# Altium schematic sheet IRSensor.SchDoc
size A4; SheetNumber: 8; SheetTotal: 11
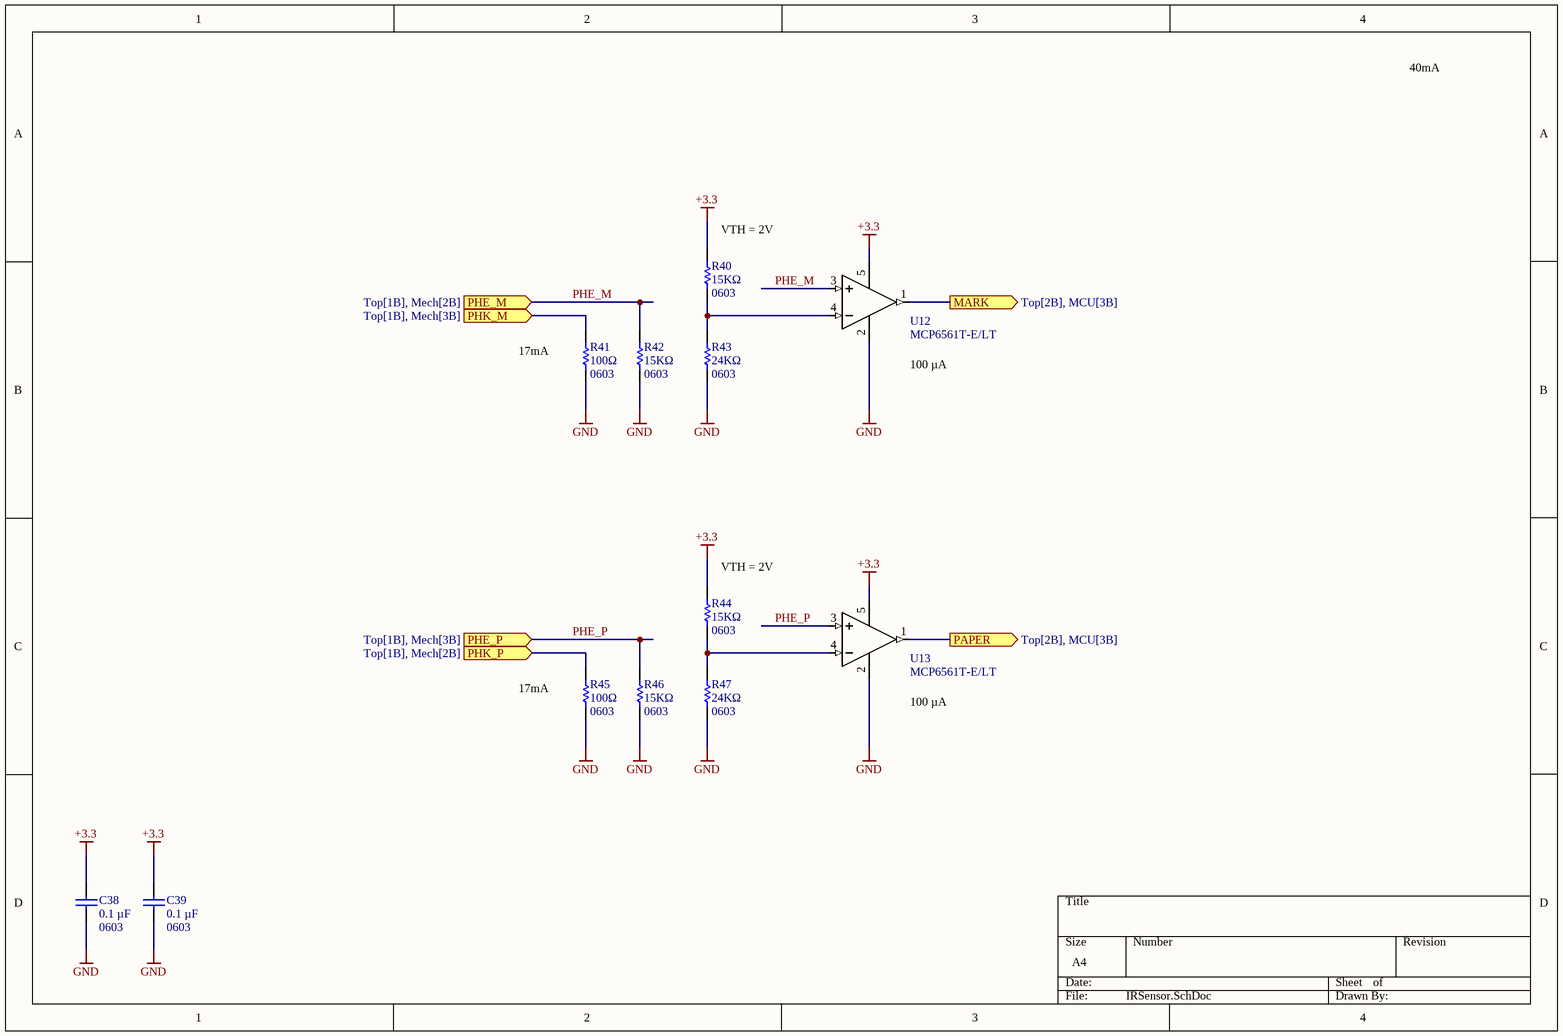
[diagram p0: IRSensor.SchDoc]

## Parts
C38  value 0.1 µF  [0603]  (hidden comment: GRM188R72A104MA35J)
C39  value 0.1 µF  [0603]  (hidden comment: GRM188R72A104MA35J)
R40  value 15KΩ  [0603]  (hidden comment: RMCF0603FG15K0)
R41  value 100Ω  [0603]  (hidden comment: RMCF0603FG100R)
R42  value 15KΩ  [0603]  (hidden comment: RMCF0603FG15K0)
R43  value 24KΩ  [0603]  (hidden comment: RMCF0603FG24K0)
R44  value 15KΩ  [0603]  (hidden comment: RMCF0603FG15K0)
R45  value 100Ω  [0603]  (hidden comment: RMCF0603FG100R)
R46  value 15KΩ  [0603]  (hidden comment: RMCF0603FG15K0)
R47  value 24KΩ  [0603]  (hidden comment: RMCF0603FG24K0)
U12  MCP6561T-E/LT  [SC-70-5]
U13  MCP6561T-E/LT  [SC-70-5]

## Ports
MARK (out, see Top[2B], MCU[3B]), PAPER (out, see Top[2B], MCU[3B]), PHE_M (in, see Top[1B], Mech[2B]), PHE_P (in, see Top[1B], Mech[3B]), PHK_M (in, see Top[1B], Mech[3B]), PHK_P (in, see Top[1B], Mech[2B])

## Nets
+3.3: C38.1 C39.1 R40.2 R44.2 U12.5(V+) U13.5(V+)
GND: C38.2 C39.2 R41.1 R42.1 R43.1 R45.1 R46.1 R47.1 U12.2(V-) U13.2(V-)
MARK: U12.1(OUT) ; port MARK
PAPER: U13.1(OUT) ; port PAPER
PHE_M: R42.2 U12.3(+IN) ; port PHE_M
PHE_P: R46.2 U13.3(+IN) ; port PHE_P
PHK_M: R41.2 ; port PHK_M
PHK_P: R45.2 ; port PHK_P
NetR40_1: R40.1 R43.2 U12.4(-IN)
NetR44_1: R44.1 R47.2 U13.4(-IN)

## Notes on the sheet
- 40mA
- (near R40) VTH = 2V
- (near R41) 17mA
- (near U12) 100 µA
- (near R44) VTH = 2V
- (near R45) 17mA
- (near U13) 100 µA

## Library data of the parts
C38 C39 = GRM188R72A104MA35J: 0.1 µF ±20% 100V Ceramic Capacitor X7R 0603 (1608 Metric); Case: 0603; Tolerance: ±20%; Temperature Coefficient: X7R; Voltage: 100V
R40 R42 R44 R46 = RMCF0603FG15K0: 15 kOhms ±1% 0.1W, 1/10W Chip Resistor 0603 (1608 Metric) Automotive AEC-Q200 Thick Film; Case: 0603; Tolerance: 1%; Power: 0.1W
R41 R45 = RMCF0603FG100R: 100 Ohms ±1% 0.1W, 1/10W Chip Resistor 0603 (1608 Metric) Automotive AEC-Q200 Thick Film; Case: 0603; Tolerance: 1%; Power: 0.1W
R43 R47 = RMCF0603FG24K0: 24 kOhms ±1% 0.1W, 1/10W Chip Resistor 0603 (1608 Metric) Automotive AEC-Q200 Thick Film; Case: 0603; Tolerance: 1%; Power: 0.1W
U12 U13 = MCP6561T-E/LT: Comparator General Purpose CMOS, Push-Pull, Rail-to-Rail, TTL SC-70-5